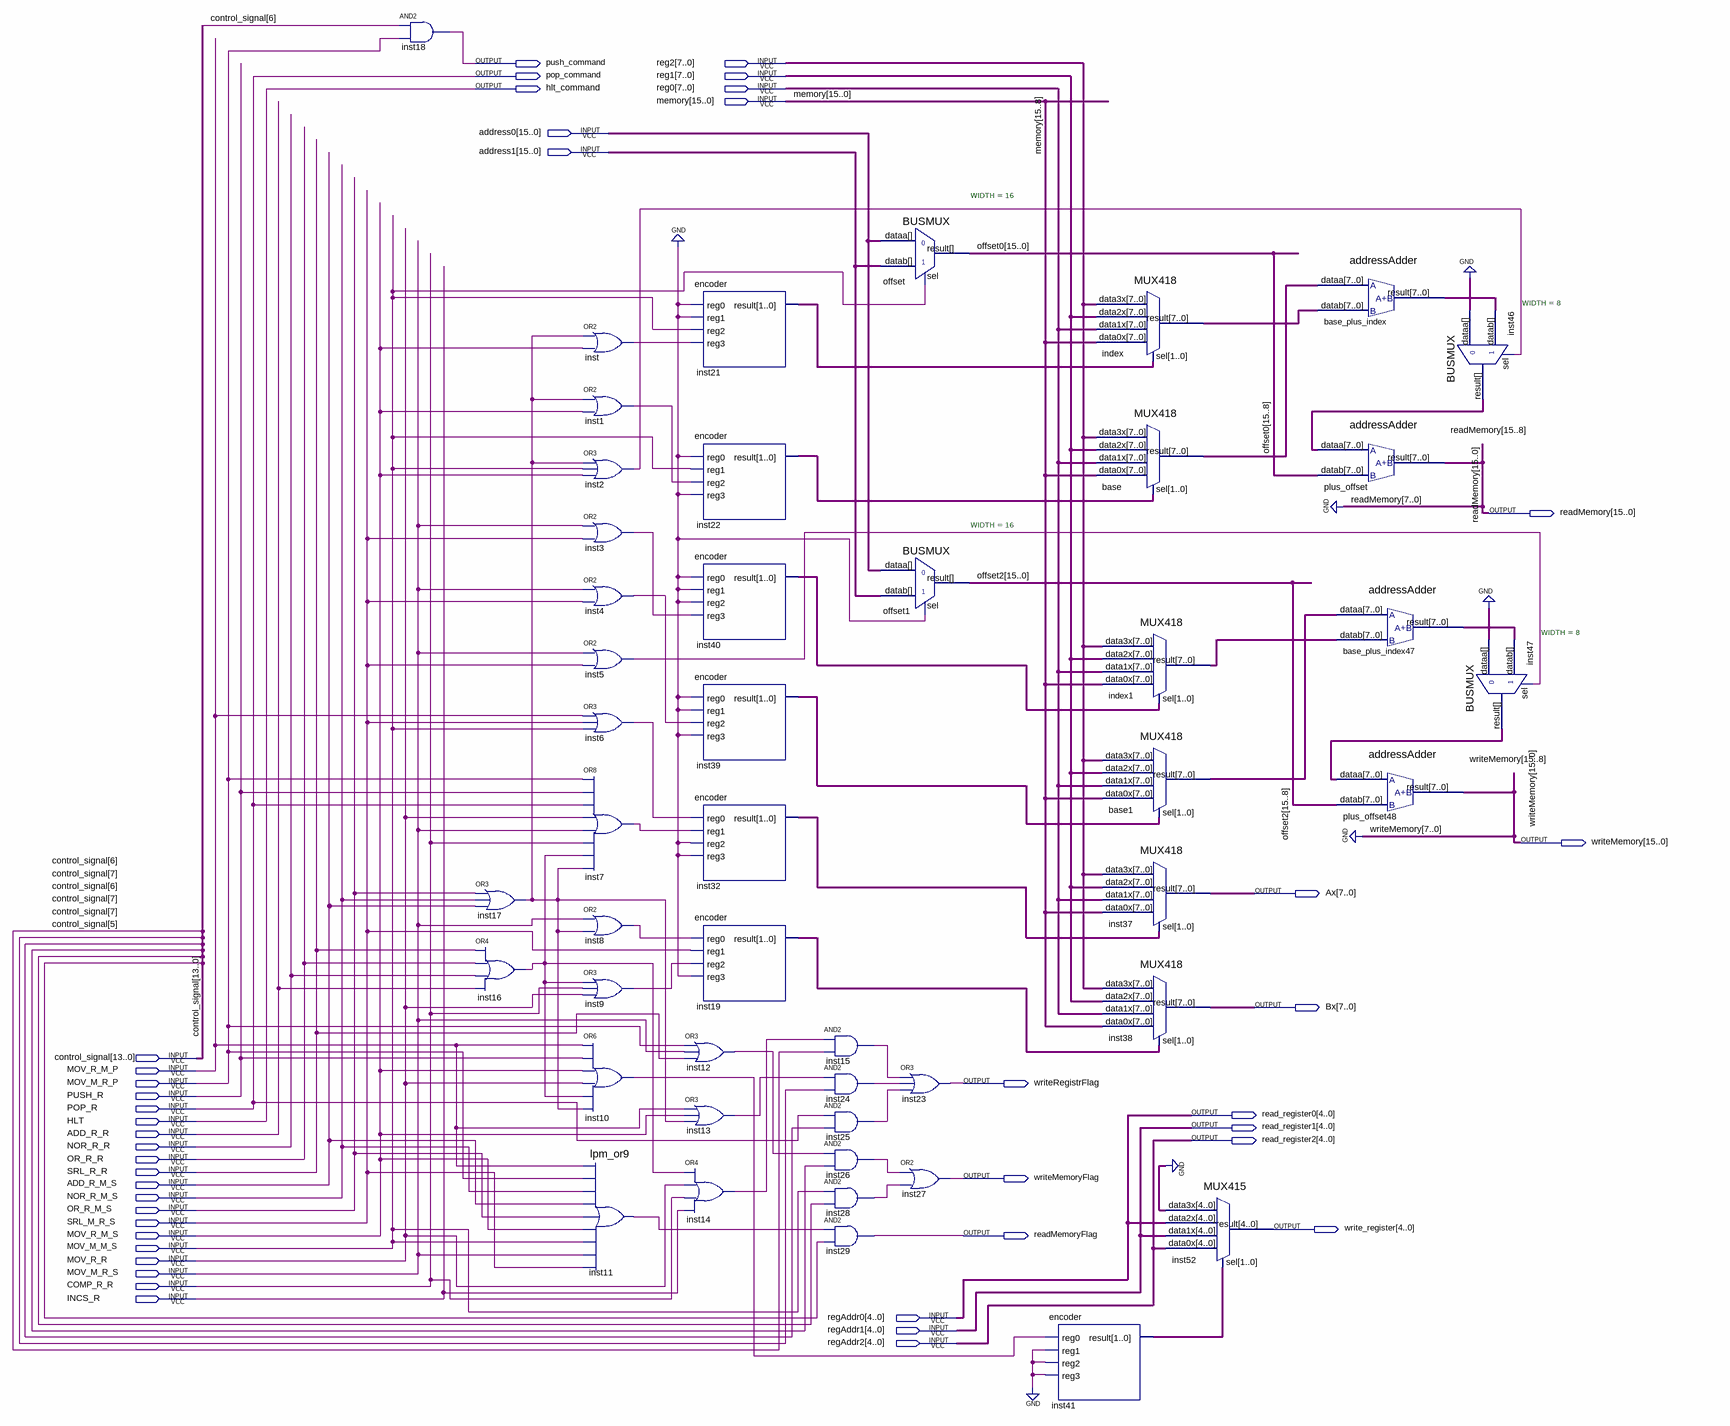
[diagram p0: schematic sheet]
// Quartus schematic CommandBlock.bdf as structural Verilog: 48 symbols, 43 pins
module CommandBlock (
  input  [7:0] reg2,
  input  [7:0] reg1,
  input  [7:0] reg0,
  input  [15:0] memory,
  input  [15:0] address0,
  input  [15:0] address1,
  input  [13:0] control_signal,
  input  MOV_R_M_P,
  input  MOV_M_R_P,
  input  PUSH_R,
  input  POP_R,
  input  HLT,
  input  ADD_R_R,
  input  NOR_R_R,
  input  OR_R_R,
  input  SRL_R_R,
  input  ADD_R_M_S,
  input  NOR_R_M_S,
  input  OR_R_M_S,
  input  SRL_M_R_S,
  input  MOV_R_M_S,
  input  MOV_M_M_S,
  input  MOV_R_R,
  input  MOV_M_R_S,
  input  COMP_R_R,
  input  INCS_R,
  input  [4:0] regAddr0,
  input  [4:0] regAddr1,
  input  [4:0] regAddr2,
  output push_command,
  output pop_command,
  output hlt_command,
  output [15:0] readMemory,
  output [15:0] writeMemory,
  output [7:0] Ax,
  output [7:0] Bx,
  output writeRegistrFlag,
  output [4:0] read_register0,
  output [4:0] read_register1,
  output [4:0] read_register2,
  output writeMemoryFlag,
  output [4:0] write_register,
  output readMemoryFlag
);

  wire inst1_out, inst2_out, inst3_out, inst4_out, inst5_out, inst6_out, inst7_out, inst8_out, inst9_out,
       inst10_out, inst11_result, inst12_out, inst13_out, inst14_out, inst15_out, inst16_out, inst17_out,
       inst24_out, inst25_out, inst26_out, inst28_out, inst_out;
  wire [1:0] inst19_result, inst21_result, inst22_result, inst32_result, inst39_result, inst40_result,
       inst41_result;
  wire [7:0] base1_result, base_plus_index47_result, base_plus_index_result, base_result, index1_result,
       index_result, inst46_result, inst47_result;
  wire [15:0] offset0, offset2;

  and inst18 (push_command, control_signal[6], MOV_M_R_P);
  or inst17 (inst17_out, OR_R_M_S, NOR_R_M_S, ADD_R_M_S);
  or inst16 (inst16_out, SRL_R_R, OR_R_R, NOR_R_R, ADD_R_R);
  or inst (inst_out, inst17_out, MOV_R_M_S);
  or inst1 (inst1_out, inst17_out, MOV_R_M_S);
  or inst2 (inst2_out, inst17_out, MOV_M_M_S, MOV_R_M_S);
  or inst3 (inst3_out, MOV_M_R_S, SRL_M_R_S);
  or inst4 (inst4_out, MOV_M_R_S, SRL_M_R_S);
  or inst5 (inst5_out, MOV_M_R_S, SRL_M_R_S);
  or inst6 (inst6_out, MOV_R_M_P, SRL_M_R_S, MOV_M_M_S);
  or inst7 (inst7_out, MOV_M_R_P, PUSH_R, POP_R, MOV_R_R, MOV_M_R_S, COMP_R_R, inst16_out, inst17_out);
  or inst8 (inst8_out, MOV_M_R_S, inst17_out);
  or inst9 (inst9_out, inst16_out, COMP_R_R, MOV_R_R);
  or inst10 (inst10_out, MOV_R_M_P, PUSH_R, MOV_R_M_S, MOV_R_R, inst16_out, inst17_out);
  lpm_or9 inst11 (
    .data0(MOV_R_M_P), .data1(MOV_M_R_P), .data2(NOR_R_M_S), .data3(ADD_R_M_S), .data4(OR_R_M_S),
    .data5(MOV_R_M_S), .data6(MOV_M_M_S), .data7(MOV_M_R_S), .data8(SRL_M_R_S), .result(inst11_result));
  or inst12 (inst12_out, MOV_M_R_P, MOV_M_R_S, SRL_R_R);
  or inst13 (inst13_out, MOV_R_M_P, MOV_R_M_S, inst17_out);
  or inst14 (inst14_out, inst16_out, MOV_R_R, COMP_R_R, INCS_R);
  encoder inst21 (.reg0(1'b0), .reg1(1'b0), .reg2(MOV_M_M_S), .reg3(inst_out), .result(inst21_result));
  encoder inst22 (.reg0(1'b0), .reg1(MOV_M_M_S), .reg2(inst1_out), .reg3(1'b0), .result(inst22_result));
  encoder inst40 (.reg0(1'b0), .reg1(1'b0), .reg2(1'b0), .reg3(inst3_out), .result(inst40_result));
  encoder inst39 (.reg0(1'b0), .reg1(1'b0), .reg2(inst4_out), .reg3(1'b0), .result(inst39_result));
  encoder inst32 (.reg0(inst6_out), .reg1(inst7_out), .reg2(1'b0), .reg3(1'b0), .result(inst32_result));
  encoder inst19 (.reg0(inst8_out), .reg1(SRL_M_R_S), .reg2(inst9_out), .reg3(1'b0), .result(inst19_result));
  and inst15 (inst15_out, inst14_out, control_signal[6]);
  and inst24 (inst24_out, inst13_out, control_signal[7]);
  and inst25 (inst25_out, POP_R, control_signal[6]);
  and inst26 (inst26_out, inst12_out, control_signal[7]);
  and inst28 (inst28_out, MOV_M_M_S, control_signal[7]);
  and inst29 (readMemoryFlag, inst11_result, control_signal[5]);
  BUSMUX #(.WIDTH(16)) offset (.datab(address1), .sel(MOV_M_M_S), .dataa(address0), .result(offset0));
  BUSMUX #(.WIDTH(16)) offset1 (.datab(address1), .sel(1'b0), .dataa(address0), .result(offset2));
  or inst23 (writeRegistrFlag, inst15_out, inst24_out, inst25_out);
  or inst27 (writeMemoryFlag, inst26_out, inst28_out);
  encoder inst41 (.reg0(inst10_out), .reg1(1'b0), .reg2(1'b0), .reg3(1'b0), .result(inst41_result));
  MUX418 index (
    .data3x(reg2), .data2x(reg1), .data1x(reg0), .data0x(memory[15:8]), .sel(inst21_result),
    .result(index_result));
  MUX418 base (
    .data3x(reg2), .data2x(reg1), .data1x(reg0), .data0x(memory[15:8]), .sel(inst22_result),
    .result(base_result));
  MUX418 index1 (
    .data3x(reg2), .data2x(reg1), .data1x(reg0), .data0x(memory[15:8]), .sel(inst40_result),
    .result(index1_result));
  MUX418 base1 (
    .data3x(reg2), .data2x(reg1), .data1x(reg0), .data0x(memory[15:8]), .sel(inst39_result),
    .result(base1_result));
  MUX418 inst37 (.data3x(reg2), .data2x(reg1), .data1x(reg0), .data0x(memory[15:8]), .sel(inst32_result), .result(Ax));
  MUX418 inst38 (.data3x(reg2), .data2x(reg1), .data1x(reg0), .data0x(memory[15:8]), .sel(inst19_result), .result(Bx));
  MUX415 inst52 (
    .data3x({5{1'b0}}), .data2x(regAddr0), .data1x(regAddr1), .data0x(regAddr2), .sel(inst41_result),
    .result(write_register));
  addressAdder base_plus_index (.dataa(base_result), .datab(index_result), .result(base_plus_index_result));
  addressAdder plus_offset (.dataa(inst46_result), .datab(offset0[15:8]), .result(readMemory[15:8]));
  addressAdder base_plus_index47 (.dataa(base1_result), .datab(index1_result), .result(base_plus_index47_result));
  addressAdder plus_offset48 (.dataa(inst47_result), .datab(offset2[15:8]), .result(writeMemory[15:8]));
  BUSMUX #(.WIDTH(8)) inst46 (
    .datab(base_plus_index_result), .sel(inst2_out), .dataa({8{1'b0}}), .result(inst46_result));
  BUSMUX #(.WIDTH(8)) inst47 (
    .datab(base_plus_index47_result), .sel(inst5_out), .dataa({8{1'b0}}), .result(inst47_result));

  assign hlt_command = HLT;
  assign pop_command = POP_R;
  assign read_register0 = regAddr0;
  assign read_register1 = regAddr1;
  assign read_register2 = regAddr2;
  assign readMemory[7:0] = {8{1'b0}};
  assign writeMemory[7:0] = {8{1'b0}};
endmodule
